# EAGLE design Battery pack (EAGLE 9.6.2)
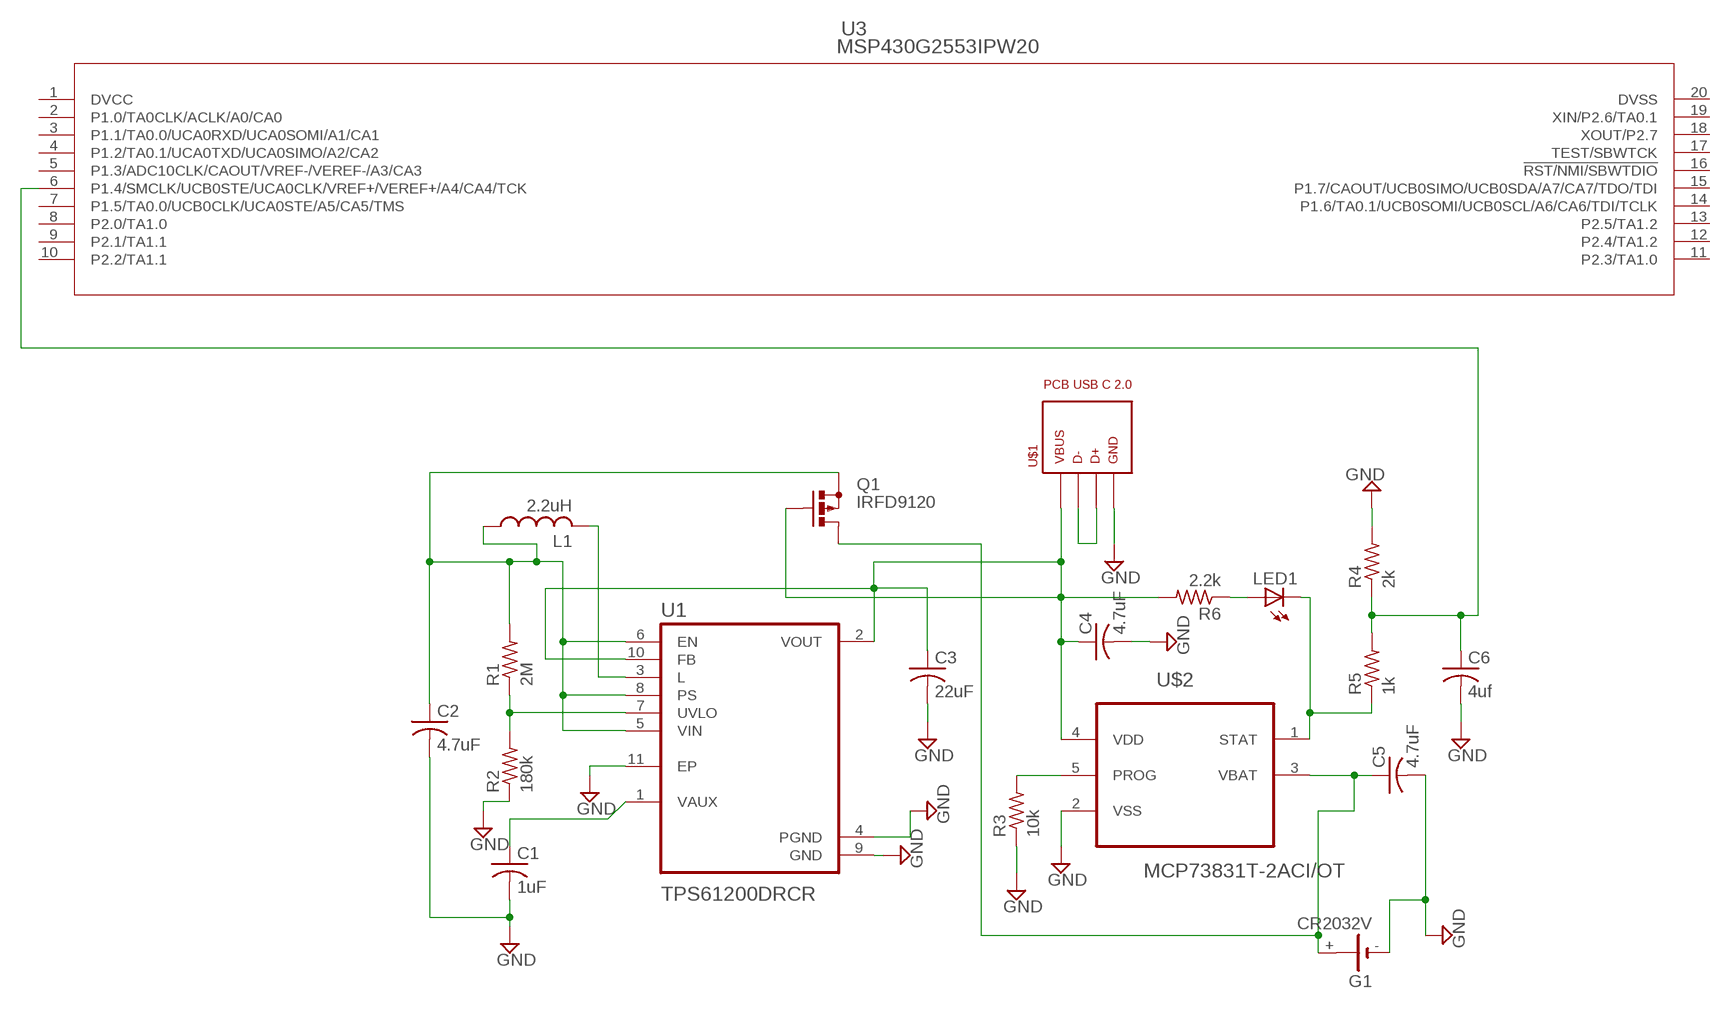
[diagram p0: schematic, sheet 1]

## Parts
C1  1uF  C-US150-064X183  [C150-064X183]
C2  4.7uF  C-US150-064X183  [C150-064X183]
C3  22uF  C-US150-064X183  [C150-064X183]
C4  4.7uF  C-US150-064X183  [C150-064X183]
C5  4.7uF  C-US150-064X183  [C150-064X183]
C6  4uf  C-US150-064X183  [C150-064X183]
G1  CR2032V  [CR2032V]
L1  2.2uH  L-US0207/15  [0207/15]
LED1  LEDB155  [Q62902-B155]
Q1  IRFD9120  [C370-01]
R1  2M  R-US_0207/15  [0207/15]
R2  180k  R-US_0207/15  [0207/15]
R3  10k  R-US_0207/15  [0207/15]
R4  2k  R-US_0207/15  [0207/15]
R5  1k  R-US_0207/15  [0207/15]
R6  2.2k  R-US_0207/15  [0207/15]
U1  TPS61200DRCR  [VREG_V62/16624-01YE]
U3  MSP430G2553IPW20  [PW20]
U$1  PCB_USB_C_2.0DS_1  [USB_TYPE_C_DS_1]
U$2  MCP73831T-2ACI/OT  [SOT95P280X145-5N]

## Nets
GND: C1.2 C2.2 C3.2 C4.2 C5.2 C6.2 G1.- R2.1 R3.1 R4.2 U1.4(PGND) U1.9(GND) U1.11(EP) U$1.A1(GND) U$1.A12(GND) U$1.B1(GND) U$1.B12(GND) U$2.2(VSS)
N$1: R1.1 R2.2 U1.7(UVLO)
N$2: C3.1 C4.1 Q1.G R6.2 U1.2(VOUT) U1.10(FB) U$1.A4(VBUS) U$1.A9(VBUS) U$1.B4(VBUS) U$1.B9(VBUS) U$2.4(VDD)
N$3: C2.1 L1.1 Q1.S R1.2 U1.5(VIN) U1.6(EN) U1.8(PS)
N$4: C1.1 U1.1(VAUX)
N$5: L1.2 U1.3(L)
N$7: U$1.A6(D+) U$1.A7(D-) U$1.B6(D+) U$1.B7(D-)
N$8: R3.2 U$2.5(PROG)
N$9: LED1.K(C) R5.1 U$2.1(STAT)
N$11: C6.1 R4.1 R5.2 U3.6(P1.4/SMCLK/UCB0STE/UCA0CLK/VREF+/VEREF+/A4/CA4/TCK)
N$12: LED1.A R6.1
N$14: C5.1 G1.+ Q1.D Q1.D1(D) U$2.3(VBAT)
Unconnected: G1.+@1(+) U3.2(P1.0/TA0CLK/ACLK/A0/CA0) U3.3(P1.1/TA0.0/UCA0RXD/UCA0SOMI/A1/CA1) U3.4(P1.2/TA0.1/UCA0TXD/UCA0SIMO/A2/CA2) U3.5(P1.3/ADC10CLK/CAOUT/VREF-/VEREF-/A3/CA3) U3.7(P1.5/TA0.0/UCB0CLK/UCA0STE/A5/CA5/TMS) U3.8(P2.0/TA1.0) U3.9(P2.1/TA1.1) U3.10(P2.2/TA1.1) U3.11(P2.3/TA1.0) U3.12(P2.4/TA1.2) U3.13(P2.5/TA1.2) U3.14(P1.6/TA0.1/UCB0SOMI/UCB0SCL/A6/CA6/TDI/TCLK) U3.15(P1.7/CAOUT/UCB0SIMO/UCB0SDA/A7/CA7/TDO/TDI) U3.16(!RST/NMI/SBWTDIO) U3.17(TEST/SBWTCK) U3.18(XOUT/P2.7) U3.19(XIN/P2.6/TA0.1)

## Power pins joined to a net without a drawn wire
DVCC: U3.1(DVCC)
DVSS: U3.20(DVSS)

## Library data of the parts
C1-C6 = adafruit:C-US: CAPACITOR, American symbol
G1 = battery:CR2032V: LI BATTERY Varta
L1 = rcl:L-US: INDUCTOR, American symbol; SPICEPREFIX: L
LED1 = adafruit:LED: LED OSRAM: - CHIPLED LG R971, LG N971, LY N971, LG Q971, LY Q971, LO R971, LY R971 LH N974, LH R974 LS Q976, LO Q976, LY Q976 LO Q996 - Hyper CHIPLED LW Q18S LB Q993, LB Q99A, LB R99A - SideLED LS A670, LO A670, LY A670, LG A670, LP A670 LB A673, LV A673, LT A673, LW A673 LH A674 LY A675 LS A676, LA A676, LO A676, LY A676, LW A676 LS A679, LY A679, LG A679 - Hyper Micro SIDELED® LS Y876, LA Y876, LO Y876, LY Y876 LT Y87S - SmartLED LW L88C, LW L88S LB L89C, LB L89S, LG L890 LS L89K, LO L89K, LY L89K LS L896, LA L896, LO L896, LY L896 - TOPLED LS T670, LO T670, LY T670, LG T670, LP T670 LSG T670, LSP T670, LSY T670, LOP T670, LYG T670 LG T671, LOG T671, LSG T671 LB T673, LV T673, LT T673, LW T673 LH T674 LS T676, LA T676, LO T676, LY T676, LB T676, LH T676, LSB T676, LW T676 LB T67C, LV T67C, LT T67C, LS T67K, LO T67K, LY T67K, LW E67C LS E67B, LA E67B, LO E67B, LY E67B, LB E67C, LV E67C, LT E67C LW T67C LS T679, LY T679, LG T679 LS T770, LO T770, LY T770, LG T770, LP T770 LB T773, LV T773, LT T773, LW T773 LH T774 LS E675, LA E675, LY E675, LS T675 LS T776, LA T776, LO T776, LY T776, LB T776 LHGB T686 LT T68C, LB T68C - Hyper Mini TOPLED® LB M676 - Mini TOPLED Santana® LG M470 LS M47K, LO M47K, LY M47K Source: http://www.osram.convergy.de/
Q1 = transistor-small-signal:IRFD9120: P-CHANNEL MOS FET
R1-R6 = adafruit:R-US_: RESISTOR, American symbol
U1 = TPS61200DRCR:TPS61200DRCR; AVAILABILITY: Unavailable; DESCRIPTION: 0.3V Input Voltage Boost Converter with 1.3A Switches and 'Down Mode' in 3x3 QFN 10-VSON -40 to 85; MF: Texas Instruments; MP: TPS61200DRCR; PACKAGE: VSON-10 Texas Instruments; PRICE: None; PURCHASE-URL: https://pricing.snapeda.com/search/part/TPS61200DRCR/?ref=eda
U3 = msp32pin:MSP430G2553IPW20; DATASHEET_URL: http://www.ti.com/lit/gpn/MSP430G2553; DESCRIPTION: MSP430G2x53, MSP430G2x13 Mixed Signal Microcontroller; FAMILY_NAME: Value Line; GENERIC_PART_NUMBER: MSP430G2553; INDUSTRY_STD_PKG_TYPE: TSSOP; MANUFACTURER: Texas Instruments; MANUFACTURER_PART_NUMBER: MSP430G2553IPW20; PACKAGE_DESIGNATOR: PW; PIN_COUNT: 20; VENDOR: Texas Instruments
U$1 = USB_pcb_connectors:PCB_USB_C_2.0
U$2 = MCP73831T-2ACI_OT:MCP73831T-2ACI/OT: Charge Management Controller Check prices <https://pricing.snapeda.com/search/part/MCP73831T-2ACI/OT/?ref=eda>; AVAILABILITY: Good; DESCRIPTION: Charger IC Lithium Ion/Polymer SOT-23-5; MF: Microchip; MP: MCP73831T-2ACI/OT; PACKAGE: SOT-23 Microchip; PRICE: None; PURCHASE-URL: https://pricing.snapeda.com/search/part/MCP73831T-2ACI/OT/?ref=eda

## Board
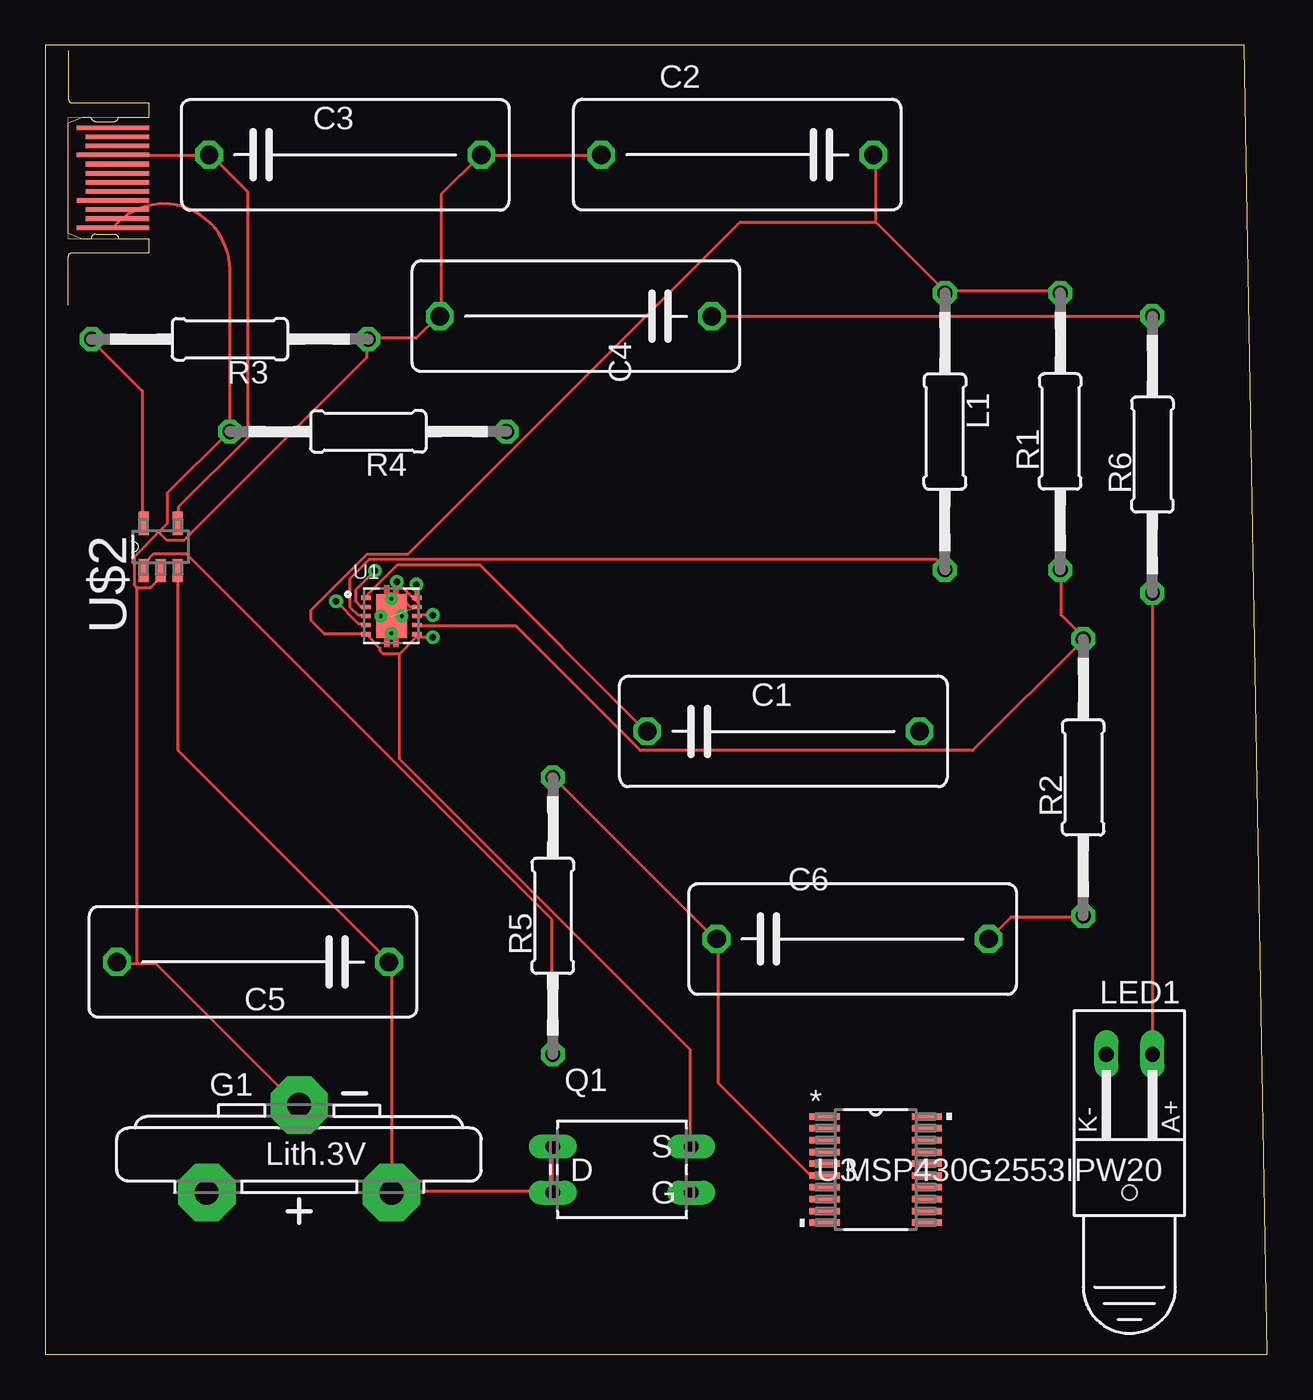
[diagram p1: board, top side]
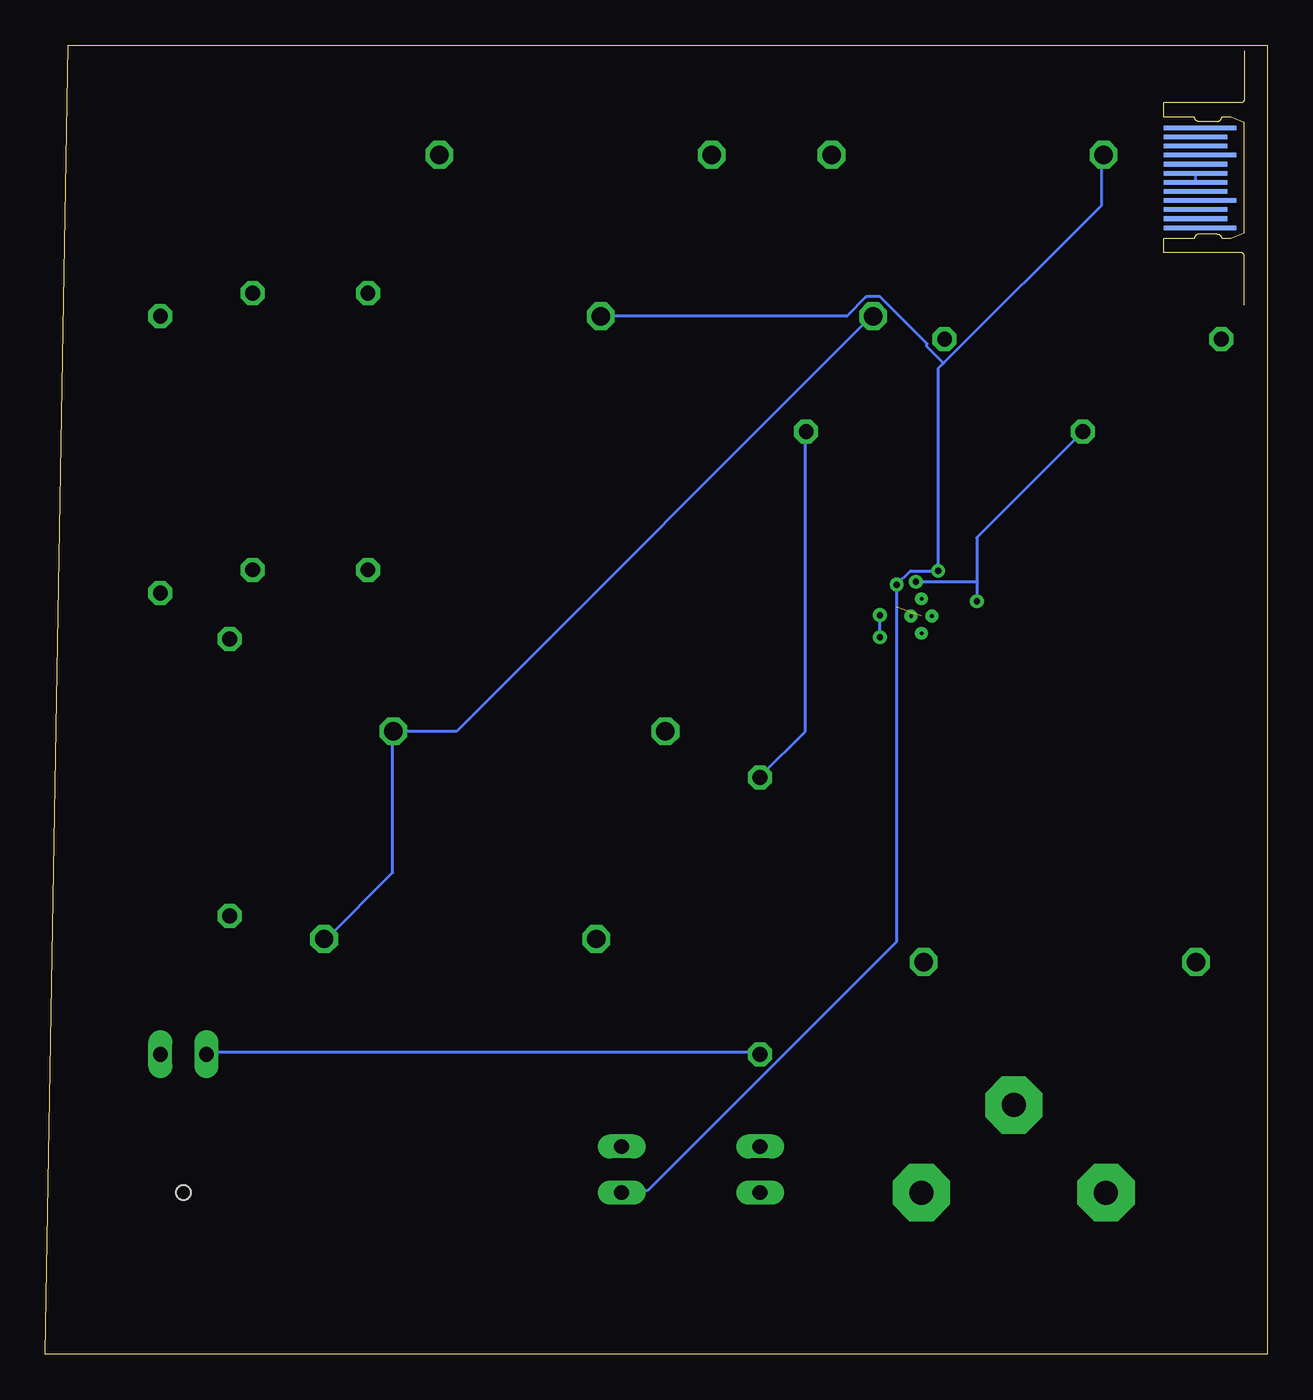
[diagram p2: board, bottom side, seen from below]

Size 67.29 x 72.06 mm. Coordinates in mm from the lower left corner, seen from the top.
Outline: 0,0 67.29,0 66.02,72.06 0,72.06 0,0
Copper layers (1*16): Top 0.035mm / dielectric 1.5mm / Bottom 0.035mm
Design rules "default": minimum track width 6mil, minimum drill 0.35mm, track to track 6mil, track to pad 6mil, pad to pad 6mil, via to via 6mil, smd to smd 6mil, copper to edge 40mil, drill to drill 6mil, minimum pad ring 10mil, minimum via ring 8mil, stop-mask expansion 4mil, vias tented up to drill 0mil, thermal gap 10mil

### Footprints (pad centres in the part's own frame; a part is rotated, then mirrored left to right if it is on the bottom)
C150-064X183 = drill 1.016 octagon: 1 -7.493,0; 2 7.493,0
CR2032V = drill 1.321 pad 3.15 octagon: + -2.54,-5.08; +@1 -2.54,5.08; - 2.286,0
0207/15 = drill 0.813 octagon: 1 -7.62,0; 2 7.62,0
Q62902-B155 = drill 0.813 long: A 7.62,-1.27; K 7.62,1.27 | hole 0.813: 0,0
C370-01 = drill 0.813 long: D -3.81,1.27; D1 -3.81,-1.27; G 3.81,-1.27; S 3.81,1.27
VREG_V62/16624-01YE = smd 0.6 x 0.24: 1 -1.4,1; 2 -1.4,0.5; 3 -1.4,0; 4 -1.4,-0.5; 5 -1.4,-1; 6 1.4,-1; 7 1.4,-0.5; 8 1.4,0; 9 1.4,0.5; 10 1.4,1 | smd 1.65 x 2.4: 11 0,0 | drill 0.2 pad 0.3: 12 0,-0.95; 13 -0.575,0; 14 0.575,0; 15 0,0.95
PW20 = smd 1.676 x 0.356: 1 -2.819,2.925; 2 -2.819,2.275; 3 -2.819,1.625; 4 -2.819,0.975; 5 -2.819,0.325; 6 -2.819,-0.325; 7 -2.819,-0.975; 8 -2.819,-1.625; 9 -2.819,-2.275; 10 -2.819,-2.925; 11 2.819,-2.925; 12 2.819,-2.275; 13 2.819,-1.625; 14 2.819,-0.975; 15 2.819,-0.325; 16 2.819,0.325; 17 2.819,0.975; 18 2.819,1.625; 19 2.819,2.275; 20 2.819,2.925
USB_TYPE_C_DS_1 = smd 0.25 x 4: A1 2.75,-2.45; A4 1.25,-2.45; A9 -1.25,-2.45; A12 -2.75,-2.45 | smd 0.25 x 3.5: A2 2.25,-2.7; A3 1.75,-2.7; A5 0.75,-2.7; A6 0.25,-2.7; A7 -0.25,-2.7; A8 -0.75,-2.7; A10 -1.75,-2.7; A11 -2.25,-2.7 | smd 0.25 x 4 bottom: B1 -2.75,-2.45; B4 -1.25,-2.45; B9 1.25,-2.45; B12 2.75,-2.45 | smd 0.25 x 3.5 bottom: B2 -2.25,-2.7; B3 -1.75,-2.7; B5 -0.75,-2.7; B6 -0.25,-2.7; B7 0.25,-2.7; B8 0.75,-2.7; B10 1.75,-2.7; B11 2.25,-2.7
SOT95P280X145-5N = smd 1.27 x 0.559: 1 -1.295,0.94; 2 -1.295,0; 3 -1.295,-0.94; 4 1.295,-0.94; 5 1.295,0.94

### Placement (x,y rotation side)
C1  40.64,34.29 0 top
C2  38.1,66.04 180 top
C3  16.51,66.04 0 top
C4  29.21,57.15 180 top
C5  11.43,21.59 180 top
C6  44.45,22.86 0 top
G1  13.97,11.43 90 top
L1  49.53,50.8 270 top
LED1  59.69,8.89 90 top
Q1  31.75,10.16 0 top
R1  55.88,50.8 90 top
R2  57.15,31.75 90 top
R3  10.16,55.88 180 top
R4  17.78,50.8 180 top
R5  27.94,24.13 90 top
R6  60.96,49.53 90 top
U1  19.05,40.64 0 top
U3  45.72,10.16 0 top
U$1  1.27,64.77 90 top
U$2  6.35,44.45 90 top

### Tracks (layer width: path | path; a pad name or v marks a point on that pad's centre or on a via)
GND  (via drill 0.35)  (1 unrouted)
  Top 0.152: 5.03,21.49 6.1,21.49 13.87,13.72 G1.- | 5.03,21.49 3.96,21.49 C5.2 | R2.1 57.15,24.08 53.19,24.08 51.97,22.86 C6.2 | v16,41.45 17.22,40.23 17.53,40.23 U1.4 | 5.03,42.22 5.79,42.22 6.25,42.67 6.25,43.13 U$2.2 | 5.03,42.22 4.88,42.37 4.88,43.89 6.25,45.26 | 6.25,45.26 6.71,45.72 6.71,47.4 10.06,50.75 R4.2 10.16,59.69 arc140 U$1.B1 | C2.2 30.48,65.99 24.08,65.99 C3.2 23.93,65.99 21.79,63.86 21.79,57.15 C4.2 21.64,57.15 20.42,55.93 17.83,55.93 R3.1 17.68,55.78 17.68,54.86 7.62,44.81 6.71,44.81 6.25,45.26 | 5.03,42.22 5.03,21.49 | 20.45,41.42 19.96,41.91 | 19.96,41.91 v19.36,42.52 | 19.96,41.91 19.81,41.76 19.81,41.45 20.12,41.15 20.42,41.15 U1.9
  Bottom 0.152: C6.2 51.82,22.86 48.16,26.52 48.16,34.29 C1.2 44.65,34.29 21.79,57.15 C4.2 | 16,42.52 16,44.96 R4.2 | 16,42.52 v16,41.45 | 16,42.52 v19.36,42.52
N$1
  Top 0.152: U1.7 20.57,40.08 25.91,40.08 32.77,33.22 51.05,33.22 57.15,39.32 R2.2 57.15,39.47 55.93,40.69 55.93,43.13 R1.1
N$2  (via drill 0.35)
  Top 0.152: C4.1 R6.2 | v18.14,43.13 17.07,42.06 17.07,41.45 17.37,41.15 17.53,41.15 U1.2 | v20.42,42.37 20.42,41.76 U1.10 | U$2.4 7.32,45.87 7.32,46.63 11.12,50.44 11.12,64.01 9.14,65.99 C3.1 8.99,65.99 3.81,65.99 U$1.B9
  Bottom 0.152: 17.83,54.56 9.14,63.25 9.14,65.99 C3.1 | 17.83,54.56 18.14,54.25 v18.14,43.13 19.66,43.13 v20.42,42.37 20.42,22.71 34.14,8.99 35.51,8.99 Q1.G | C4.1 23.16,57.15 22.1,58.22 21.34,58.22 18.75,55.63 18.75,55.47 17.83,54.56
N$3  (via drill 0.35)
  Top 0.152: 49.53,58.52 55.78,58.52 R1.2 | 45.72,62.33 45.72,65.99 C2.1 | 49.53,58.52 45.72,62.33 | 49.53,58.52 L1.1 | 19.51,38.56 18.59,38.56 18.44,38.71 18.44,38.86 17.68,39.62 U1.5 15.38,39.64 14.63,40.39 14.63,40.97 17.7,44.04 19.96,44.04 38.25,62.33 45.72,62.33 | 20.42,39.47 20.57,39.62 U1.6 | 20.42,39.47 19.51,38.56 | v21.34,40.69 20.57,40.69 U1.8 | 20.42,39.47 v21.34,39.47 | 19.51,38.56 19.51,32.77 35.51,16.76 35.51,11.43 Q1.S
  Bottom 0.152: v21.34,39.47 v21.34,40.69
N$4
  Top 0.152: U1.1 17.68,41.76 19.36,43.43 23.93,43.43 33.07,34.29 C1.1
N$5
  Top 0.152: U1.3 17.53,40.69 17.22,40.69 16.76,41.15 16.76,42.67 17.83,43.74 49.07,43.74 49.53,43.28 L1.2
N$7
  Bottom 0.152: U$1.A7 3.96,64.62 3.96,64.92 U$1.B7
N$8
  Top 0.152: U$2.5 5.33,45.87 5.33,53.04 2.59,55.78 R3.2
N$9
  Top 0.152: U$2.1 5.49,43.28 5.49,43.59 5.94,44.04 7.77,44.04 27.89,23.93 27.89,16.61 R5.1
  Bottom 0.152: LED1.K 58.37,16.61 28.04,16.61 R5.1
N$11
  Top 0.152: U3.6 42.82,9.91 42.06,9.91 37.03,14.93 37.03,22.86 C6.1 36.88,22.86 28.04,31.7 R5.2
  Bottom 0.152: R4.1 25.45,50.75 25.45,34.29 27.89,31.85 R5.2
N$12
  Top 0.152: R6.1 LED1.A
N$14
  Top 0.152: 27.89,8.99 27.89,11.43 Q1.D | 19.05,8.99 27.89,8.99 | 27.89,8.99 Q1.D1 | U$2.3 7.32,43.13 7.32,33.22 18.9,21.64 C5.1 19.05,21.49 19.05,8.99 | 19.05,8.99 G1.+